# Altium project terra-core.PrjPcb
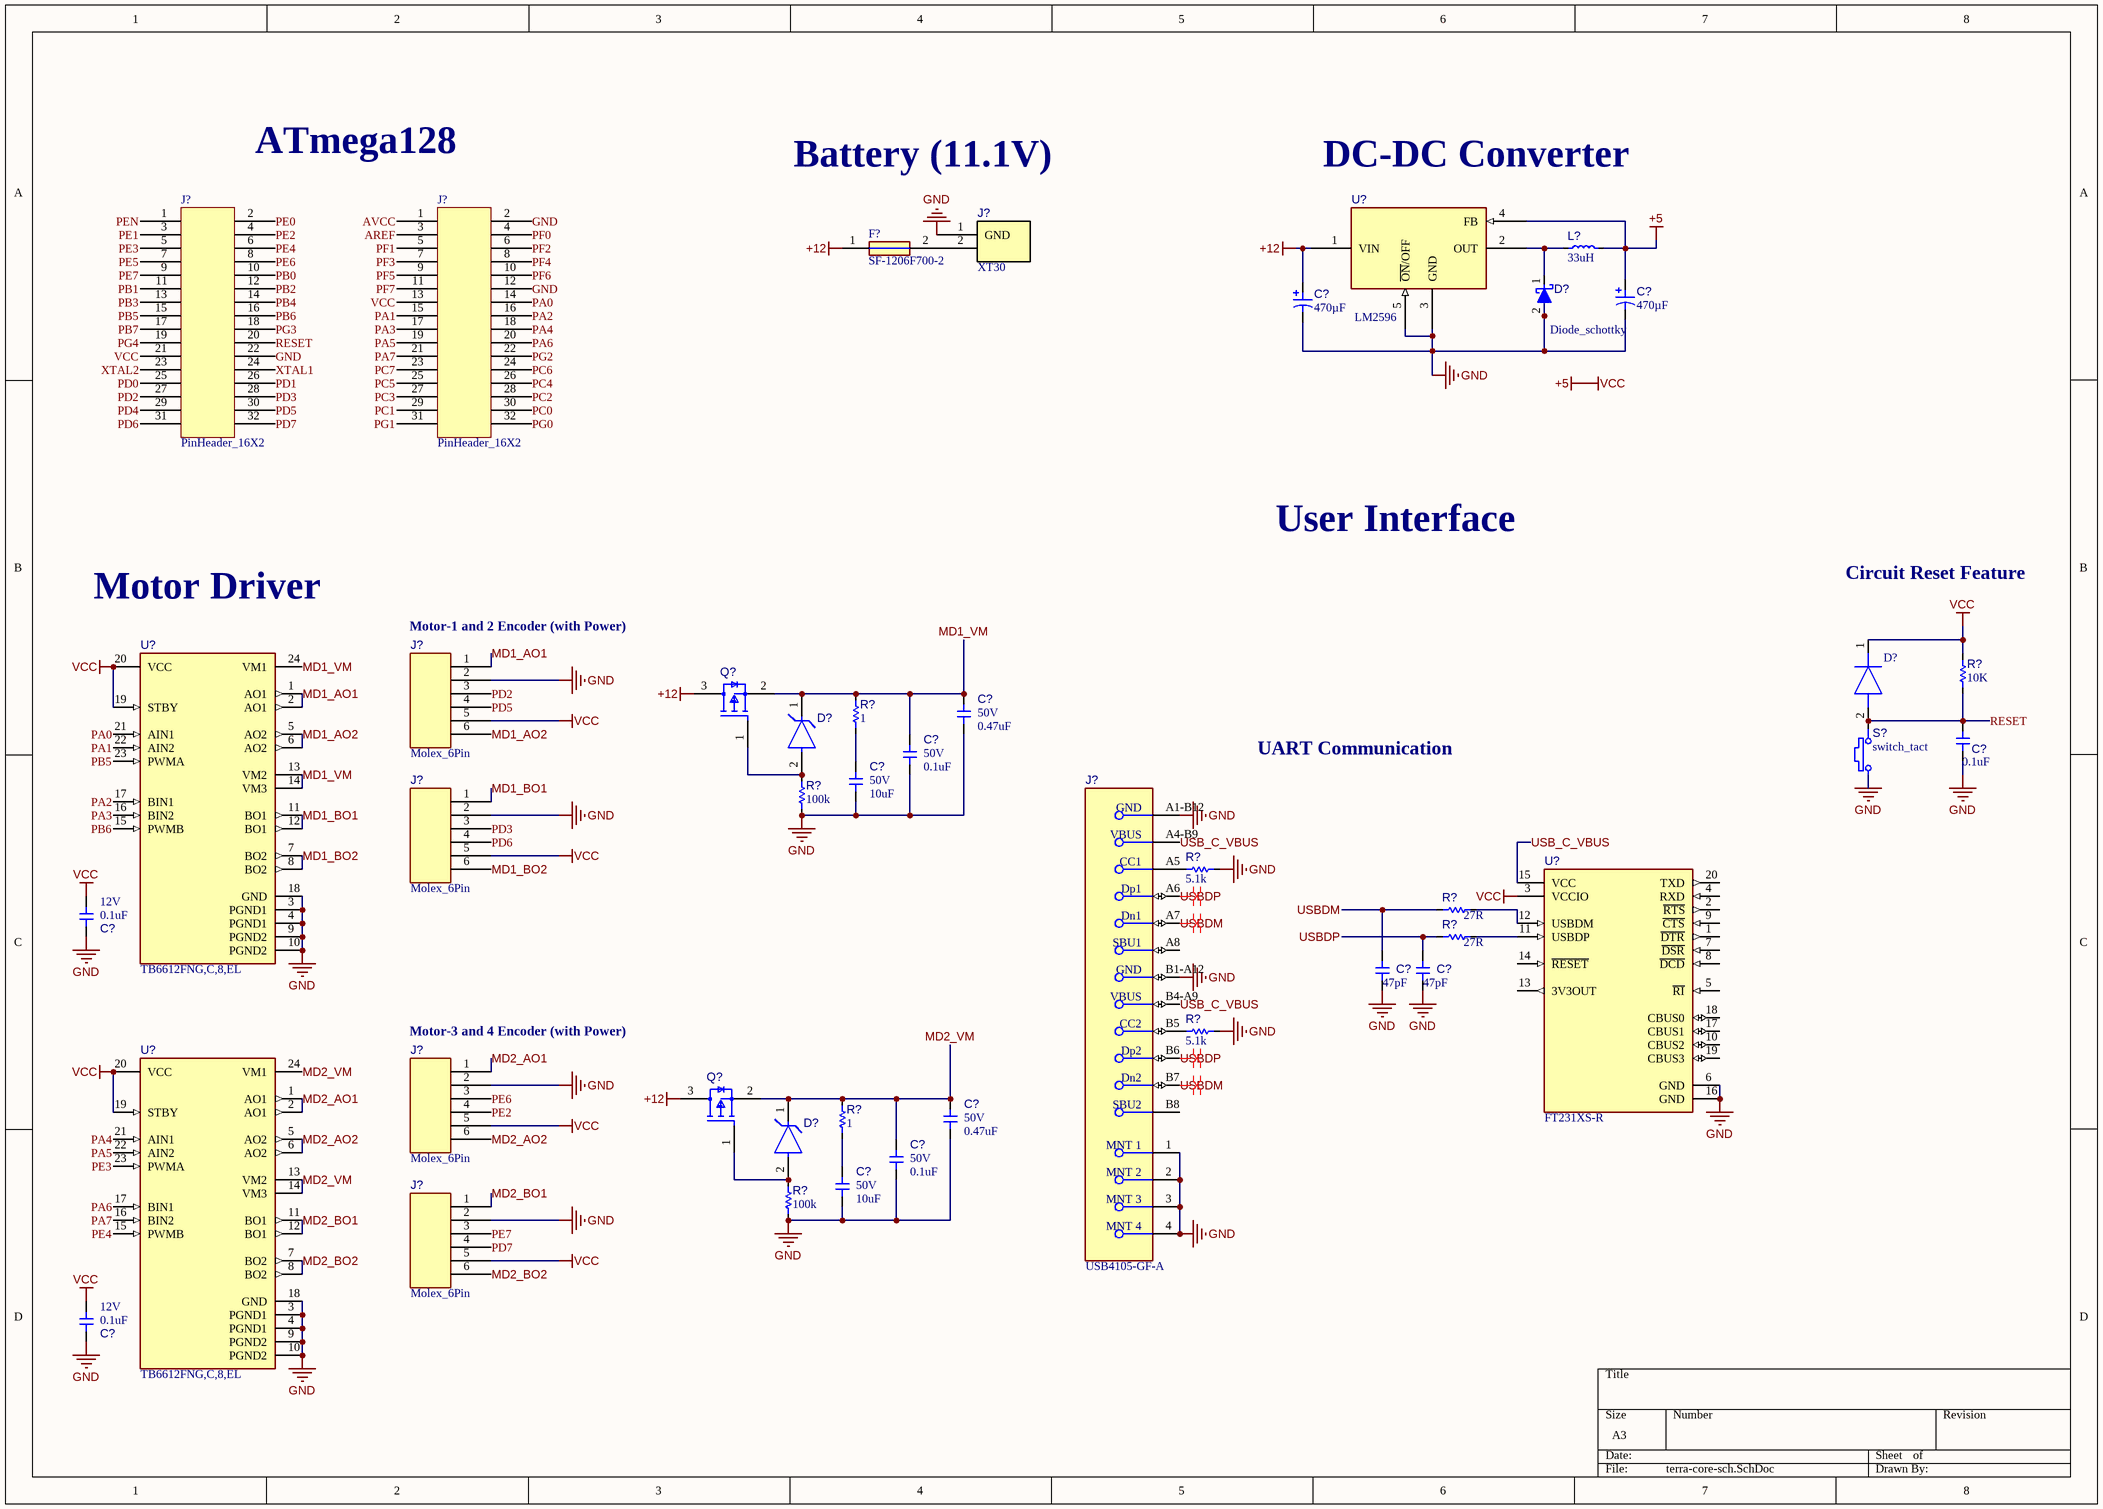
[diagram p0: terra-core-sch.SchDoc]
1 sheet, 43 parts. Net scope: global (net labels, ports and power ports of the same name join across sheets).

## Sheet terra-core-sch.SchDoc
size A3; SheetNumber: 1; SheetTotal: 1

### Parts
(Parts that share a designator on the sheet are numbered #1, #2 ... from top to bottom, then left to right.)
C?#1  Capacitance: 470µF  [SMD_Capacitor_electrolytic]  (hidden comment: Polar_Capacitors)
C?#2  Capacitance: 470µF  [SMD_Capacitor_electrolytic]  (hidden comment: Polar_Capacitors)
C?#3  Voltage: 50V  Capacitance: 0.47uF  [SMD_Capacitor]  (hidden comment: non-polar_Capacitor)
C?#4  Capacitance: 0.1uF  [SMD_Capacitor]  (hidden comment: non-polar_Capacitor)
C?#5  Voltage: 50V  Capacitance: 0.1uF  [SMD_Capacitor]  (hidden comment: non-polar_Capacitor)
C?#6  Voltage: 50V  Capacitance: 10uF  [SMD_Capacitor]  (hidden comment: non-polar_Capacitor)
C?#7  Voltage: 12V  Capacitance: 0.1uF  [SMD_Capacitor]  (hidden comment: non-polar_Capacitor)
C?#8  Capacitance: 47pF  [SMD_Capacitor]  (hidden comment: non-polar_Capacitor)
C?#9  Capacitance: 47pF  [SMD_Capacitor]  (hidden comment: non-polar_Capacitor)
C?#10  Voltage: 50V  Capacitance: 0.47uF  [SMD_Capacitor]  (hidden comment: non-polar_Capacitor)
C?#11  Voltage: 50V  Capacitance: 0.1uF  [SMD_Capacitor]  (hidden comment: non-polar_Capacitor)
C?#12  Voltage: 50V  Capacitance: 10uF  [SMD_Capacitor]  (hidden comment: non-polar_Capacitor)
C?#13  Voltage: 12V  Capacitance: 0.1uF  [SMD_Capacitor]  (hidden comment: non-polar_Capacitor)
D?#1  Diode_schottky  [SMD_Diode_schottky]
D?#2  1N4148W_R1_00001  [SOD3816X135N]  (value not drawn)
D?#3  BZT52C6V8S-7-F  [FP-SOD323-IPC_A]  (value not drawn)
D?#4  BZT52C6V8S-7-F  [FP-SOD323-IPC_A]  (value not drawn)
F?  SF-1206F700-2  [FUSC3116X70N]
J?#1  XT30  [XT-30-Footprint-1]
J?#2  PinHeader_16X2  [PinHeader 16x2PIN]
J?#3  PinHeader_16X2  [PinHeader 16x2PIN]
J?#4  Molex_6Pin  [MOLEX_6PIN]
J?#5  USB4105-GF-A  [FP-USB4105-GF-A-MFG]
J?#6  Molex_6Pin  [MOLEX_6PIN]
J?#7  Molex_6Pin  [MOLEX_6PIN]
J?#8  Molex_6Pin  [MOLEX_6PIN]
L?  Inductance: 33uH  [SMD_INDUCTOR_POWER]  (hidden comment: Inductor_Power)
Q?#1  DMP3099L-7  [FP-SOT23-IPC_B]  (value not drawn)
Q?#2  DMP3099L-7  [FP-SOT23-IPC_B]  (value not drawn)
R?#1  Resistance: 10K  [SMD_Resistor]  (hidden comment: Resistor)
R?#2  Resistance: 1  [SMD_Resistor]  (hidden comment: Resistor)
R?#3  Resistance: 100k  [SMD_Resistor]  (hidden comment: Resistor)
R?#4  Resistance: 5.1k  [SMD_Resistor]  (hidden comment: Resistor)
R?#5  Resistance: 27R  [SMD_Resistor]  (hidden comment: Resistor)
R?#6  Resistance: 27R  [SMD_Resistor]  (hidden comment: Resistor)
R?#7  Resistance: 5.1k  [SMD_Resistor]  (hidden comment: Resistor)
R?#8  Resistance: 1  [SMD_Resistor]  (hidden comment: Resistor)
R?#9  Resistance: 100k  [SMD_Resistor]  (hidden comment: Resistor)
S?  switch_tact  [SMD_PUSH_SW]
U?#1  LM2596  [SMD_LM2596]
U?#2  TB6612FNG,C,8,EL  [FP-SSOP24-P-300-0_65A-IPC_A]
U?#3  FT231XS-R  [FP-SSOP-20-MFG]
U?#4  TB6612FNG,C,8,EL  [FP-SSOP24-P-300-0_65A-IPC_A]

### Nets
+12: C?#1.2 F?.1 Q?#1.3(D) Q?#2.3(D) U?#1.1(VIN)
GND: C?#1.1 C?#2.1 C?#3.1 C?#4.1 C?#5.1 C?#6.1 C?#7.1 C?#8.1 C?#9.1 C?#10.1 C?#11.1 C?#12.1 C?#13.1 D?#1.2 J?#1.1(GND) J?#2.22 J?#3.2 J?#3.12 J?#4.2 J?#5.1(MNT_1) J?#5.2(MNT_2) J?#5.3(MNT_3) J?#5.4(MNT_4) J?#5.A1-B12(GND) J?#5.B1-A12(GND) J?#6.2 J?#7.2 J?#8.2 R?#3.1 R?#4.2 R?#7.2 R?#9.1 S?.1 U?#1.3(GND) U?#1.5(~{ON}/OFF) U?#2.3(PGND1) U?#2.4(PGND1) U?#2.9(PGND2) U?#2.10(PGND2) U?#2.18(GND) U?#3.6(GND) U?#3.16(GND) U?#4.3(PGND1) U?#4.4(PGND1) U?#4.9(PGND2) U?#4.10(PGND2) U?#4.18(GND)
VCC: C?#2.2 C?#7.2 C?#13.2 D?#2.1(K) J?#2.21 J?#3.13 J?#4.5 J?#6.5 J?#7.5 J?#8.5 L?.2 R?#1.2 U?#1.4(FB) U?#2.19(STBY) U?#2.20(VCC) U?#3.3(VCCIO) U?#4.19(STBY) U?#4.20(VCC)  [also labelled +5]
AREF: J?#3.3
AVCC: J?#3.1
MD1_AO1: J?#4.1 U?#2.1(AO1) U?#2.2(AO1)
MD1_AO2: J?#4.6 U?#2.5(AO2) U?#2.6(AO2)
MD1_BO1: J?#6.1 U?#2.11(BO1) U?#2.12(BO1)
MD1_BO2: J?#6.6 U?#2.7(BO2) U?#2.8(BO2)
MD1_VM: C?#3.2 C?#5.2 D?#3.1(C) Q?#1.2(S) R?#2.2 U?#2.13(VM2) U?#2.14(VM3) U?#2.24(VM1)
MD2_AO1: J?#7.1 U?#4.1(AO1) U?#4.2(AO1)
MD2_AO2: J?#7.6 U?#4.5(AO2) U?#4.6(AO2)
MD2_BO1: J?#8.1 U?#4.11(BO1) U?#4.12(BO1)
MD2_BO2: J?#8.6 U?#4.7(BO2) U?#4.8(BO2)
MD2_VM: C?#10.2 C?#11.2 D?#4.1(C) Q?#2.2(S) R?#8.2 U?#4.13(VM2) U?#4.14(VM3) U?#4.24(VM1)
PA0: J?#3.14 U?#2.21(AIN1)
PA1: J?#3.15 U?#2.22(AIN2)
PA2: J?#3.16 U?#2.17(BIN1)
PA3: J?#3.17 U?#2.16(BIN2)
PA4: J?#3.18 U?#4.21(AIN1)
PA5: J?#3.19 U?#4.22(AIN2)
PA6: J?#3.20 U?#4.17(BIN1)
PA7: J?#3.21 U?#4.16(BIN2)
PB0: J?#2.10
PB1: J?#2.11
PB2: J?#2.12
PB3: J?#2.13
PB4: J?#2.14
PB5: J?#2.15 U?#2.23(PWMA)
PB6: J?#2.16 U?#2.15(PWMB)
PB7: J?#2.17
PC0: J?#3.30
PC1: J?#3.29
PC2: J?#3.28
PC3: J?#3.27
PC4: J?#3.26
PC5: J?#3.25
PC6: J?#3.24
PC7: J?#3.23
PD0: J?#2.25
PD1: J?#2.26
PD2: J?#2.27 J?#4.3
PD3: J?#2.28 J?#6.3
PD4: J?#2.29
PD5: J?#2.30 J?#4.4
PD6: J?#2.31 J?#6.4
PD7: J?#2.32 J?#8.4
PE0: J?#2.2
PE1: J?#2.3
PE2: J?#2.4 J?#7.4
PE3: J?#2.5 U?#4.23(PWMA)
PE4: J?#2.6 U?#4.15(PWMB)
PE5: J?#2.7
PE6: J?#2.8 J?#7.3
PE7: J?#2.9 J?#8.3
PEN: J?#2.1
PF0: J?#3.4
PF1: J?#3.5
PF2: J?#3.6
PF3: J?#3.7
PF4: J?#3.8
PF5: J?#3.9
PF6: J?#3.10
PF7: J?#3.11
PG0: J?#3.32
PG1: J?#3.31
PG2: J?#3.22
PG3: J?#2.18
PG4: J?#2.19
RESET: C?#4.2 D?#2.2(A) J?#2.20 R?#1.1 S?.2
USB_C_VBUS: J?#5.A4-B9(VBUS) J?#5.B4-A9(VBUS) U?#3.15(VCC)
USBDM: C?#8.2 J?#5.A7(Dn1) J?#5.B7(Dn2) R?#5.1
USBDP: C?#9.2 J?#5.A6(Dp1) J?#5.B6(Dp2) R?#6.1
XTAL1: J?#2.24
XTAL2: J?#2.23
NetC?#6_2: C?#6.2 R?#2.1
NetC?#12_2: C?#12.2 R?#8.1
NetD?#1_1: D?#1.1 L?.1 U?#1.2(OUT)
NetD?#3_2: D?#3.2(A) Q?#1.1(G) R?#3.2
NetD?#4_2: D?#4.2(A) Q?#2.1(G) R?#9.2
NetF?_2: F?.2 J?#1.2
NetJ?#5_A5: J?#5.A5(CC1) R?#4.1
NetJ?#5_B5: J?#5.B5(CC2) R?#7.1
NetR?#5_2: R?#5.2 U?#3.12(USBDM)
NetR?#6_2: R?#6.2 U?#3.11(USBDP)

Not connected (* = marked no-connect by the designer): J?#5 A8(SBU1) B8(SBU2); U?#3 1(~{DTR}) 2(~{RTS}) 4(RXD) 5(~{RI}) 7(~{DSR}) 8(~{DCD}) 9(~{CTS}) 10(CBUS2) 13(3V3OUT) 14(~{RESET}) 17(CBUS1) 18(CBUS0) 19(CBUS3) 20(TXD)

### Layout directives
differential pair: USBDM, USBDP

### Notes on the sheet
- ATmega128
- Battery (11.1V)
- DC-DC Converter
- User Interface
- Motor Driver
- Circuit Reset Feature
- (near J?#4) Motor-1 and 2 Encoder (with Power)
- UART Communication
- (near J?#7) Motor-3 and 4 Encoder (with Power)

### Library data of the parts
C?#1 C?#2 = CMP-024-000022-3: Electrolytic Capacitor; Design Item ID: Capacitor_electrolytic; Source: robit_passive.SchLib
C?#3 C?#5-C?#7 C?#10-C?#13 = CMP-024-000020-16: SMD type ceramic capacitor; Source: robit_passive.SchLib; Design Item ID: Capacitor
C?#4 C?#8 C?#9 = CMP-024-000020-16: SMD type ceramic capacitor; Voltage: 50V; Source: robit_passive.SchLib; Design Item ID: Capacitor
D?#1 = CMP-026-000009-1: Schottky Barrier Diode; Design Item ID: Diode_schottky; Source: robit_passive.SchLib
D?#2 = 1N4148W_R1_00001: Diode; Manufacturer_Name: PANJIT; Datasheet Link: https://www.mouser.com/datasheet/2/1057/1N4148W-1869619.pdf; Height: 1.35mm; Manufacturer_Part_Number: 1N4148W_R1_00001; Mouser Part Number: 241-1N4148W_R1_00001; Mouser Price/Stock: https://www.mouser.co.uk/ProductDetail/Panjit/1N4148W_R1_00001?qs=sPbYRqrBIVnqVztCqPNVrw%3D%3D
D?#3 D?#4 = CMP-12792-000025-1: DIODE ZENER 6.8V 200MW SOD323; Tolerance: 6%; Max Reverse Leakage Current: 1uA; Impedance: 15R; ESD Protection: No; Forward Voltage: 900mV; Element Configuration: Single; Zener Current: 5mA; Output Current: 45mA; Power Dissipation: 200mW; Contact Plating: Tin; Max Operating Temperature: 150°C; Power Rating: 200mW; Height: 1mm; Working Voltage: 6.8V; Termination: SMD/SMT; Mount: Surface Mount; Length: 1.8mm; Package Quantity: 3000; Number of Pins: 2; Weight: 0.000173oz; Peak Reverse Current: 1uA; Packaging: Tape and Reel; Max Power Dissipation: 200mW; Voltage Tolerance: 6%; Zener Voltage: 6.8V; Width: 1.4mm; Voltage Rating (DC): 6.8V; Min Operating Temperature: -65°C; Lead Free: Lead Free; REACH SVHC: No SVHC; Test Current: 5mA
F? = SF-1206F700-2: Fuse; Manufacturer_Name: Bourns; Datasheet Link: http://www.bourns.com/docs/product-datasheets/sf1206f.pdf?sfvrsn=77712cd2_24; Height: 0.7mm; Manufacturer_Part_Number: SF-1206F700-2; Mouser Part Number: 652-SF-1206F700-2; Mouser Price/Stock: https://www.mouser.co.uk/ProductDetail/Bourns/SF-1206F700-2?qs=GIQXYiEeHGARcvc%2FkAhfbA%3D%3D; Arrow Part Number: SF-1206F700-2; Arrow Price/Stock: https://www.arrow.com/en/products/sf-1206f700-2/bourns?utm_currency=USD&region=nac
J?#1 = CMP-019-000060-5: XT-30; System: Connector
J?#2 J?#3 = CMP-019-000124-1: Connector, Header, 24POS, 2Row, 2.54mmPitch; System: Connector; Source: robit_connector.SchLib; Design Item ID: PinHeader_12X2
J?#4 J?#6-J?#8 = CMP-019-000047-3: Molex 6Pin Connector; Source: robit_connector.SchLib; System: Connector; Design Item ID: Molex_6Pin
J?#5 = CMP-245163-000001-1: CONN RCPT USB2.0 TYPEC 5A; Manufacturer: GCT; Description: USB - C (Type - C) USB 2.0 Receptacle Connector 24 Position Surface Mount, Right Angle; Through Hole; Voltage Rating: 20V; Is Female: yes; Current Rating: 5/6.25/1.25/0.25A; Number Of Contacts: 16; Conn Orientation: Right Angle; Device Class L1: Connectors; Category: Conn; Lead Free: Yes; RoHS: TRUE; Temperature Range High: +85°C; Digikey Description: CONN RCPT USB2.0 TYPEC 5A; Device Class L3: unset; ComponentLink2Description: Datasheet; Manufacturer Part Number: USB4105-GF-A; Package: 0; Usb Standard: USB 2.0; Device Class L2: USB Connectors; Automotive: No; Temperature Range Low: -40°C; Height: 3.46mm; Temperature: -40°C to +85°C; Contact Material: Gold,Nickel; ComponentLink2URL: https://gct.co/files/drawings/usb4105.pdf; Octopart: https://octopart.com/usb4105-gf-a-gct-106627878
L? = CMP-028-000010-1: SMD type Inductor; Source: robit_passive.SchLib; Design Item ID: Inductor_Power
Q?#1 Q?#2 = CMP-12801-000062-2: MOSFET P-CH 30V SOT23; Gate to Source Voltage (Vgs): 20V; Turn-Off Delay Time: 31ns; Drain to Source Voltage (Vdss): -30V; Fall Time: 15ns; Threshold Voltage: -2.1V; Rise Time: 5ns; Input Capacitance: 563pF; Number of Channels: 1; Drain to Source Resistance: 65mR; Element Configuration: Single; Max Power Dissipation: 1.08W; Turn-On Delay Time: 4.8ns; Continuous Drain Current (ID): 3.8A; Lead Free: Lead Free; Number of Pins: 3; Package Quantity: 3000; Width: 1.4mm; Radiation Hardening: No; Mount: Surface Mount; Case/Package: SOT-23; Contact Plating: Tin; Rds On Max: 65mR; Height: 1.1mm; REACH SVHC: No SVHC; Weight: 0.000282oz; Max Operating Temperature: 150°C; Packaging: Tape and Reel; Min Operating Temperature: -55°C; Length: 3mm
R?#1-R?#9 = CMP-029-000004-8: SMD type resistor; Design Item ID: Resistor; Source: robit_passive.SchLib
S? = CMP-030-000003-1: micro tact switch; Design Item ID: switch_tact; Source: robit_switch.SchLib
U?#1 = CMP-022-000007-1: 5V Transformer; Source: robit_ic.SchLib; Design Item ID: LM2596
U?#2 U?#4 = CMP-2100-03693-4: IC MOTOR DRIVER 2.7V-5.5V 24SSOP; Logic Function: AND GATE; Interface: Parallel; Operating Supply Voltage: 3V; Max Supply Voltage: 5.5V; Output Current: 1A; Min Supply Voltage: 2.7V; Number of Outputs: 2; Packaging: Tape and Reel; Mount: Surface Mount; Number of Pins: 24; Min Operating Temperature: -20°C; Case/Package: SSOP; Series: -; Max Operating Temperature: 85°C; Package Quantity: 1
U?#3 = CMP-0248-00024-3: IC USB SERIAL FULL UART 20SSOP; Operating Supply Voltage: 5V; Operating Supply Current: 8mA; Number of Channels: 1; Min Supply Voltage: 2.97V; Max Supply Voltage: 5.5V; Data Rate: 12Mbps; Height: 0.059inch; Packaging: Tape and Reel; Mount: Surface Mount; Package Quantity: 2000; Radiation Hardening: No; Case/Package: SSOP; Min Operating Temperature: -40°C; Width: 0.157inch; Number of Pins: 20; Weight: 0.016oz; Interface: UART; Max Operating Temperature: 85°C; Length: 8.74mm